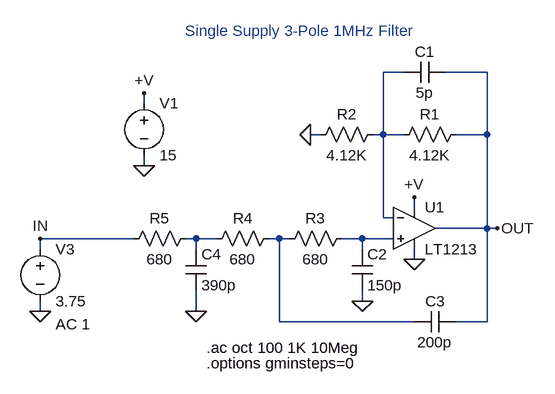
[diagram p0: schematic 1213.asc]
1213.asc, the LTspice schematic file:
Version 4
SHEET 1 896 680
WIRE 176 0 144 0
WIRE 304 0 240 0
WIRE -224 48 -224 32
WIRE 48 96 32 96
WIRE 144 96 144 0
WIRE 144 96 128 96
WIRE 176 96 144 96
WIRE 304 96 304 0
WIRE 304 96 256 96
WIRE -224 144 -224 128
WIRE 192 208 192 192
WIRE 144 224 144 96
WIRE 160 224 144 224
WIRE 304 240 304 96
WIRE 304 240 224 240
WIRE 320 240 304 240
WIRE -240 256 -384 256
WIRE -144 256 -160 256
WIRE -112 256 -144 256
WIRE -16 256 -32 256
WIRE 0 256 -16 256
WIRE 112 256 80 256
WIRE 160 256 112 256
WIRE -384 272 -384 256
WIRE -144 272 -144 256
WIRE 112 272 112 256
WIRE 192 288 192 272
WIRE 112 352 112 336
WIRE -384 368 -384 352
WIRE -144 368 -144 336
WIRE -16 384 -16 256
WIRE 192 384 -16 384
WIRE 304 384 304 240
WIRE 304 384 256 384
FLAG -224 144 0
FLAG 192 192 +V
FLAG -224 32 +V
FLAG -384 368 0
FLAG 192 288 0
FLAG 32 96 0
FLAG 112 352 0
FLAG -144 368 0
FLAG 320 240 OUT
FLAG -384 256 IN
SYMBOL voltage -224 32 R0
SYMATTR InstName V1
SYMATTR Value 15
SYMBOL voltage -384 256 R0
WINDOW 123 24 132 Left 0
WINDOW 39 0 0 Left 0
SYMATTR Value2 AC 1
SYMATTR InstName V3
SYMATTR Value 3.75
SYMBOL opamps\\LT1213 192 176 R0
SYMATTR InstName U1
SYMBOL res 272 80 R90
WINDOW 0 0 56 VBottom 0
WINDOW 3 32 56 VTop 0
SYMATTR InstName R1
SYMATTR Value 4.12K
SYMBOL cap 240 -16 R90
WINDOW 0 0 32 VBottom 0
WINDOW 3 32 32 VTop 0
SYMATTR InstName C1
SYMATTR Value 5p
SYMBOL res 144 80 R90
WINDOW 0 0 56 VBottom 0
WINDOW 3 32 56 VTop 0
SYMATTR InstName R2
SYMATTR Value 4.12K
SYMBOL res 96 240 R90
WINDOW 0 0 56 VBottom 0
WINDOW 3 32 56 VTop 0
SYMATTR InstName R3
SYMATTR Value 680
SYMBOL res -16 240 R90
WINDOW 0 0 56 VBottom 0
WINDOW 3 32 56 VTop 0
SYMATTR InstName R4
SYMATTR Value 680
SYMBOL cap 96 272 R0
SYMATTR InstName C2
SYMATTR Value 150p
SYMBOL cap 256 368 R90
WINDOW 0 0 32 VBottom 0
WINDOW 3 32 32 VTop 0
SYMATTR InstName C3
SYMATTR Value 200p
SYMBOL res -144 240 R90
WINDOW 0 0 56 VBottom 0
WINDOW 3 32 56 VTop 0
SYMATTR InstName R5
SYMATTR Value 680
SYMBOL cap -160 272 R0
SYMATTR InstName C4
SYMATTR Value 390p
TEXT 16 -48 Bottom 0 ;Single Supply 3-Pole 1MHz Filter
TEXT -128 448 Left 0 !.options gminsteps=0
TEXT -128 424 Left 0 !.ac oct 100 1K 10Meg

The netlist it stands for:
* 1213.asc
V1 +V 0 15
V3 IN 0 3.75 AC 1
XU1 N004 N001 +V 0 OUT LT1213  ; pins In+ In- V+ V- OUT
R1 OUT N001 4.12K
C1 OUT N001 5p
R2 N001 0 4.12K
R3 N004 N003 680
R4 N003 N002 680
C2 N004 0 150p
C3 OUT N003 200p
R5 N002 IN 680
C4 N002 0 390p
* Single Supply 3-Pole 1MHz Filter
.options gminsteps=0
.ac oct 100 1K 10Meg
.lib LTC.lib
.backanno
.end